# Altium schematic sheet Светодиоды.SchDoc
size A4; Organization: Protel International P/L; Address1: L3, 12a Rodborough Rd; Address2: Frenchs Forest; Address3: NSW; Address4: Australia 2086; SheetNumber: 2; SheetTotal: 2
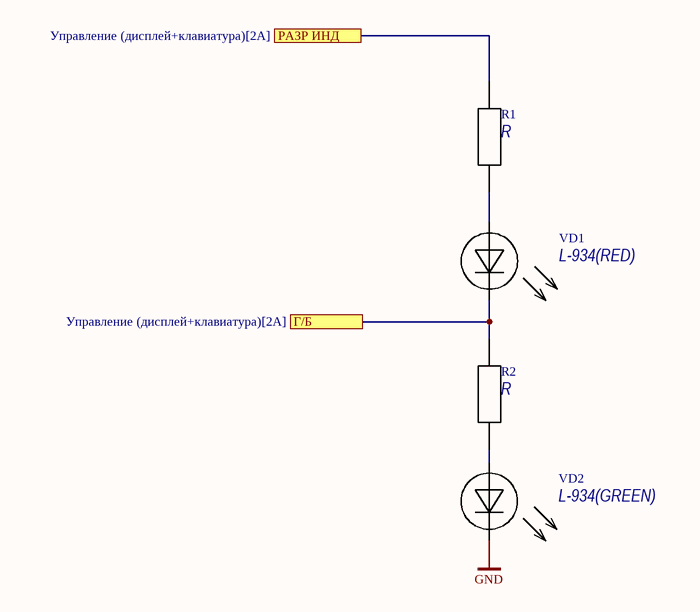
[diagram p0: Светодиоды.SchDoc]

## Parts
R1  R  [R]
R2  R  [R]
VD1  L-934(RED)  [L-934(RED)]
VD2  L-934(GREEN)  [L-934(GREEN)]

## Ports
Г/Б (see Управление (дисплей+клавиатура)[2A]), РАЗР ИНД (see Управление (дисплей+клавиатура)[2A])

## Nets
GND: VD2.2
Г/Б: R2.2 VD1.2 ; port Г/Б
РАЗР ИНД: R1.2 ; port РАЗР ИНД
NetR1_1: R1.1 VD1.1
NetR2_1: R2.1 VD2.1

## Notes on the sheet
- Title
- Size:
- Date:
- A4
- Number:
- Time:
- Revision:
- Sheet
- of
- File: